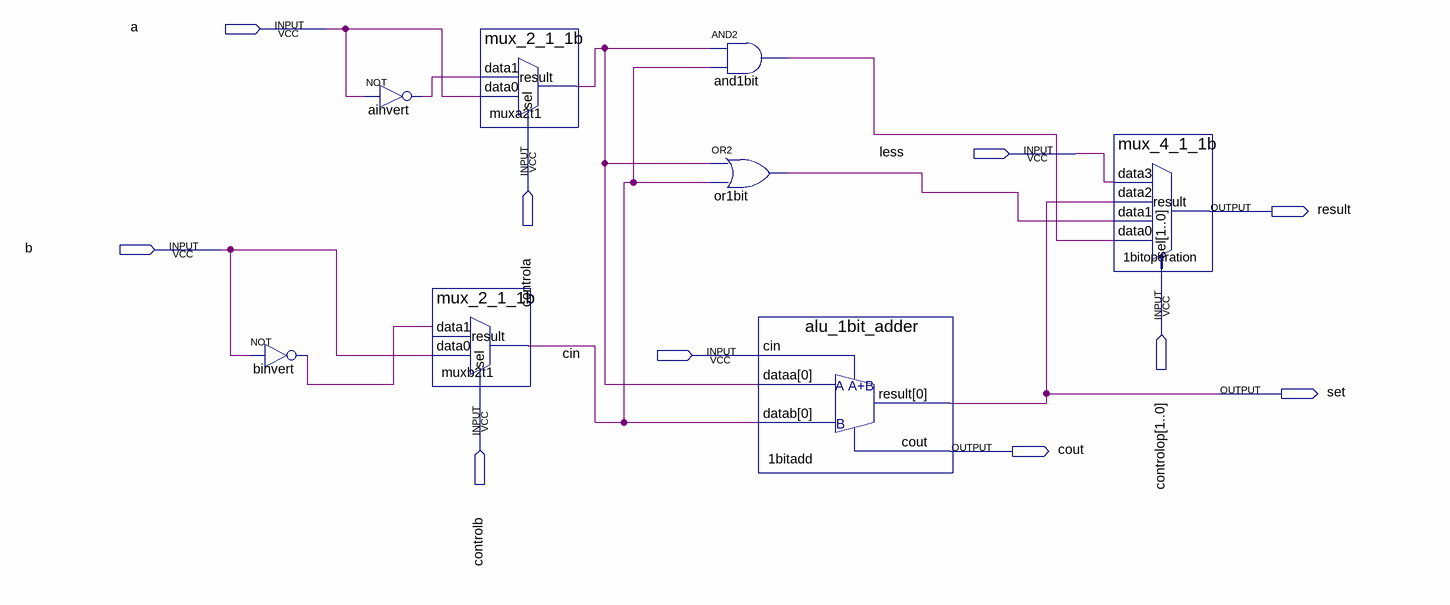
[diagram p0: schematic sheet]
// Quartus schematic onebitalu.bdf as structural Verilog: 8 symbols, 10 pins
module onebitalu (
  input  a,
  input  controla,
  input  less,
  input  b,
  input  [1:0] controlop,
  input  cin,
  input  controlb,
  output result,
  output set,
  output cout
);

  wire ainvert_out, and1bit_out, binvert_out, muxa2t1_result, muxb2t1_result, or1bit_out;

  not binvert (binvert_out, b);
  not ainvert (ainvert_out, a);
  mux_2_1_1b muxb2t1 (.data1(binvert_out), .data0(b), .sel(controlb), .result(muxb2t1_result));
  mux_2_1_1b muxa2t1 (.sel(controla), .data1(ainvert_out), .data0(a), .result(muxa2t1_result));
  and and1bit (and1bit_out, muxa2t1_result, muxb2t1_result);
  or or1bit (or1bit_out, muxa2t1_result, muxb2t1_result);
  alu_1bit_adder u_1bitadd (.cin(cin), .dataa(muxa2t1_result), .datab(muxb2t1_result), .result(set), .cout(cout));
  mux_4_1_1b u_1bitoperation (
    .data3(less), .data2(set), .data1(or1bit_out), .data0(and1bit_out), .sel(controlop), .result(result));
endmodule
